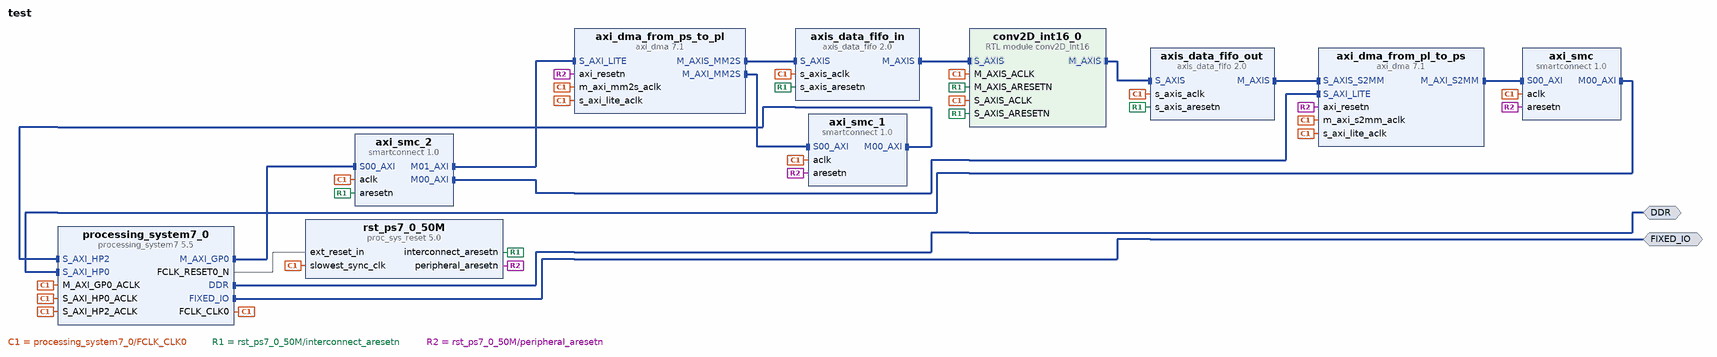
[diagram p0: block diagram of the top level]
# Vivado block design test, xc7z020clg400-3, Vivado 2021.1.1
create_bd_design test

create_bd_intf_port -mode Master -vlnv xilinx.com:interface:ddrx_rtl:1.0 DDR
create_bd_intf_port -mode Master -vlnv xilinx.com:display_processing_system7:fixedio_rtl:1.0 FIXED_IO

create_bd_cell -type ip -vlnv xilinx.com:ip:axi_dma:7.1 axi_dma_from_pl_to_ps
set_property -dict [list \
  CONFIG.c_include_mm2s 0 \
  CONFIG.c_include_sg 0 \
  CONFIG.c_sg_length_width 26 \
] [get_bd_cells axi_dma_from_pl_to_ps]
create_bd_cell -type ip -vlnv xilinx.com:ip:axi_dma:7.1 axi_dma_from_ps_to_pl
set_property -dict [list \
  CONFIG.c_include_s2mm 0 \
  CONFIG.c_include_sg 0 \
  CONFIG.c_m_axis_mm2s_tdata_width 16 \
  CONFIG.c_sg_length_width 26 \
] [get_bd_cells axi_dma_from_ps_to_pl]
create_bd_cell -type ip -vlnv xilinx.com:ip:smartconnect:1.0 axi_smc
set_property -dict {CONFIG.NUM_SI 1} [get_bd_cells axi_smc]
create_bd_cell -type ip -vlnv xilinx.com:ip:smartconnect:1.0 axi_smc_1
set_property -dict {CONFIG.NUM_SI 1} [get_bd_cells axi_smc_1]
create_bd_cell -type ip -vlnv xilinx.com:ip:smartconnect:1.0 axi_smc_2
set_property -dict {CONFIG.NUM_MI 3 CONFIG.NUM_SI 1} [get_bd_cells axi_smc_2]
create_bd_cell -type ip -vlnv xilinx.com:ip:axis_data_fifo:2.0 axis_data_fifo_in
set_property -dict {CONFIG.FIFO_DEPTH 512 CONFIG.TDATA_NUM_BYTES 2} [get_bd_cells axis_data_fifo_in]
create_bd_cell -type ip -vlnv xilinx.com:ip:axis_data_fifo:2.0 axis_data_fifo_out
set_property -dict {CONFIG.FIFO_DEPTH 512} [get_bd_cells axis_data_fifo_out]
create_bd_cell -type ip -vlnv xilinx.com:ip:processing_system7:5.5 processing_system7_0
set_property -dict [list \
  CONFIG.PCW_FPGA0_PERIPHERAL_FREQMHZ 50 \
  CONFIG.PCW_USE_S_AXI_HP0 1 \
  CONFIG.PCW_USE_S_AXI_HP2 1 \
] [get_bd_cells processing_system7_0]
# 32 more settings of processing_system7_0 are not shown: defaults, MIO pin electricals, DDR timing, and values the tool derives
create_bd_cell -type ip -vlnv xilinx.com:ip:proc_sys_reset:5.0 rst_ps7_0_50M
create_bd_cell -type module -reference conv2D_int16 conv2D_int16_0

# ---- connections ----

connect_bd_intf_net -intf_net axi_dma_0_M_AXI_S2MM [get_bd_intf_pins axi_dma_from_pl_to_ps/M_AXI_S2MM] [get_bd_intf_pins axi_smc/S00_AXI]
connect_bd_intf_net -intf_net axi_dma_1_M_AXIS_MM2S [get_bd_intf_pins axi_dma_from_ps_to_pl/M_AXIS_MM2S] [get_bd_intf_pins axis_data_fifo_in/S_AXIS]
connect_bd_intf_net -intf_net axi_dma_1_M_AXI_MM2S [get_bd_intf_pins axi_dma_from_ps_to_pl/M_AXI_MM2S] [get_bd_intf_pins axi_smc_1/S00_AXI]
connect_bd_intf_net [get_bd_intf_pins axi_smc_1/M00_AXI] [get_bd_intf_pins processing_system7_0/S_AXI_HP2]
connect_bd_intf_net [get_bd_intf_pins axi_dma_from_pl_to_ps/S_AXI_LITE] [get_bd_intf_pins axi_smc_2/M00_AXI]
connect_bd_intf_net [get_bd_intf_pins axi_dma_from_ps_to_pl/S_AXI_LITE] [get_bd_intf_pins axi_smc_2/M01_AXI]
connect_bd_intf_net [get_bd_intf_pins axi_smc/M00_AXI] [get_bd_intf_pins processing_system7_0/S_AXI_HP0]
connect_bd_intf_net -intf_net axis_data_fifo_0_M_AXIS [get_bd_intf_pins axi_dma_from_pl_to_ps/S_AXIS_S2MM] [get_bd_intf_pins axis_data_fifo_out/M_AXIS]
connect_bd_intf_net [get_bd_intf_pins axis_data_fifo_in/M_AXIS] [get_bd_intf_pins conv2D_int16_0/S_AXIS]
connect_bd_intf_net [get_bd_intf_pins conv2D_int16_0/M_AXIS] [get_bd_intf_pins axis_data_fifo_out/S_AXIS]
connect_bd_intf_net [get_bd_intf_ports DDR] [get_bd_intf_pins processing_system7_0/DDR]
connect_bd_intf_net [get_bd_intf_ports FIXED_IO] [get_bd_intf_pins processing_system7_0/FIXED_IO]
connect_bd_intf_net [get_bd_intf_pins axi_smc_2/S00_AXI] [get_bd_intf_pins processing_system7_0/M_AXI_GP0]
connect_bd_net [get_bd_pins processing_system7_0/FCLK_CLK0] \
  [get_bd_pins axi_dma_from_pl_to_ps/m_axi_s2mm_aclk] [get_bd_pins axi_dma_from_pl_to_ps/s_axi_lite_aclk] \
  [get_bd_pins axi_dma_from_ps_to_pl/m_axi_mm2s_aclk] [get_bd_pins axi_dma_from_ps_to_pl/s_axi_lite_aclk] \
  [get_bd_pins axi_smc/aclk] [get_bd_pins axi_smc_1/aclk] [get_bd_pins axi_smc_2/aclk] \
  [get_bd_pins axis_data_fifo_in/s_axis_aclk] [get_bd_pins axis_data_fifo_out/s_axis_aclk] \
  [get_bd_pins processing_system7_0/M_AXI_GP0_ACLK] [get_bd_pins processing_system7_0/S_AXI_HP0_ACLK] \
  [get_bd_pins processing_system7_0/S_AXI_HP2_ACLK] [get_bd_pins rst_ps7_0_50M/slowest_sync_clk] \
  [get_bd_pins conv2D_int16_0/M_AXIS_ACLK] [get_bd_pins conv2D_int16_0/S_AXIS_ACLK]
connect_bd_net [get_bd_pins processing_system7_0/FCLK_RESET0_N] [get_bd_pins rst_ps7_0_50M/ext_reset_in]
connect_bd_net [get_bd_pins rst_ps7_0_50M/interconnect_aresetn] \
  [get_bd_pins axi_smc_2/aresetn] [get_bd_pins axis_data_fifo_in/s_axis_aresetn] \
  [get_bd_pins axis_data_fifo_out/s_axis_aresetn] [get_bd_pins conv2D_int16_0/M_AXIS_ARESETN] \
  [get_bd_pins conv2D_int16_0/S_AXIS_ARESETN]
connect_bd_net [get_bd_pins rst_ps7_0_50M/peripheral_aresetn] \
  [get_bd_pins axi_dma_from_pl_to_ps/axi_resetn] [get_bd_pins axi_dma_from_ps_to_pl/axi_resetn] [get_bd_pins axi_smc/aresetn] \
  [get_bd_pins axi_smc_1/aresetn]

# ---- address map ----
assign_bd_address -offset 0x00000000 -range 512M -target_address_space [get_bd_addr_spaces axi_dma_from_pl_to_ps/Data_S2MM] [get_bd_addr_segs processing_system7_0/S_AXI_HP0/HP0_DDR_LOWOCM]
assign_bd_address -offset 0x00000000 -range 512M -target_address_space [get_bd_addr_spaces axi_dma_from_ps_to_pl/Data_MM2S] [get_bd_addr_segs processing_system7_0/S_AXI_HP2/HP2_DDR_LOWOCM]
assign_bd_address -offset 0x40400000 -range 64K -target_address_space [get_bd_addr_spaces processing_system7_0/Data] [get_bd_addr_segs axi_dma_from_pl_to_ps/S_AXI_LITE/Reg]
assign_bd_address -offset 0x40410000 -range 64K -target_address_space [get_bd_addr_spaces processing_system7_0/Data] [get_bd_addr_segs axi_dma_from_ps_to_pl/S_AXI_LITE/Reg]

validate_bd_design
save_bd_design
